# EAGLE schematic alim (EAGLE 4.16)
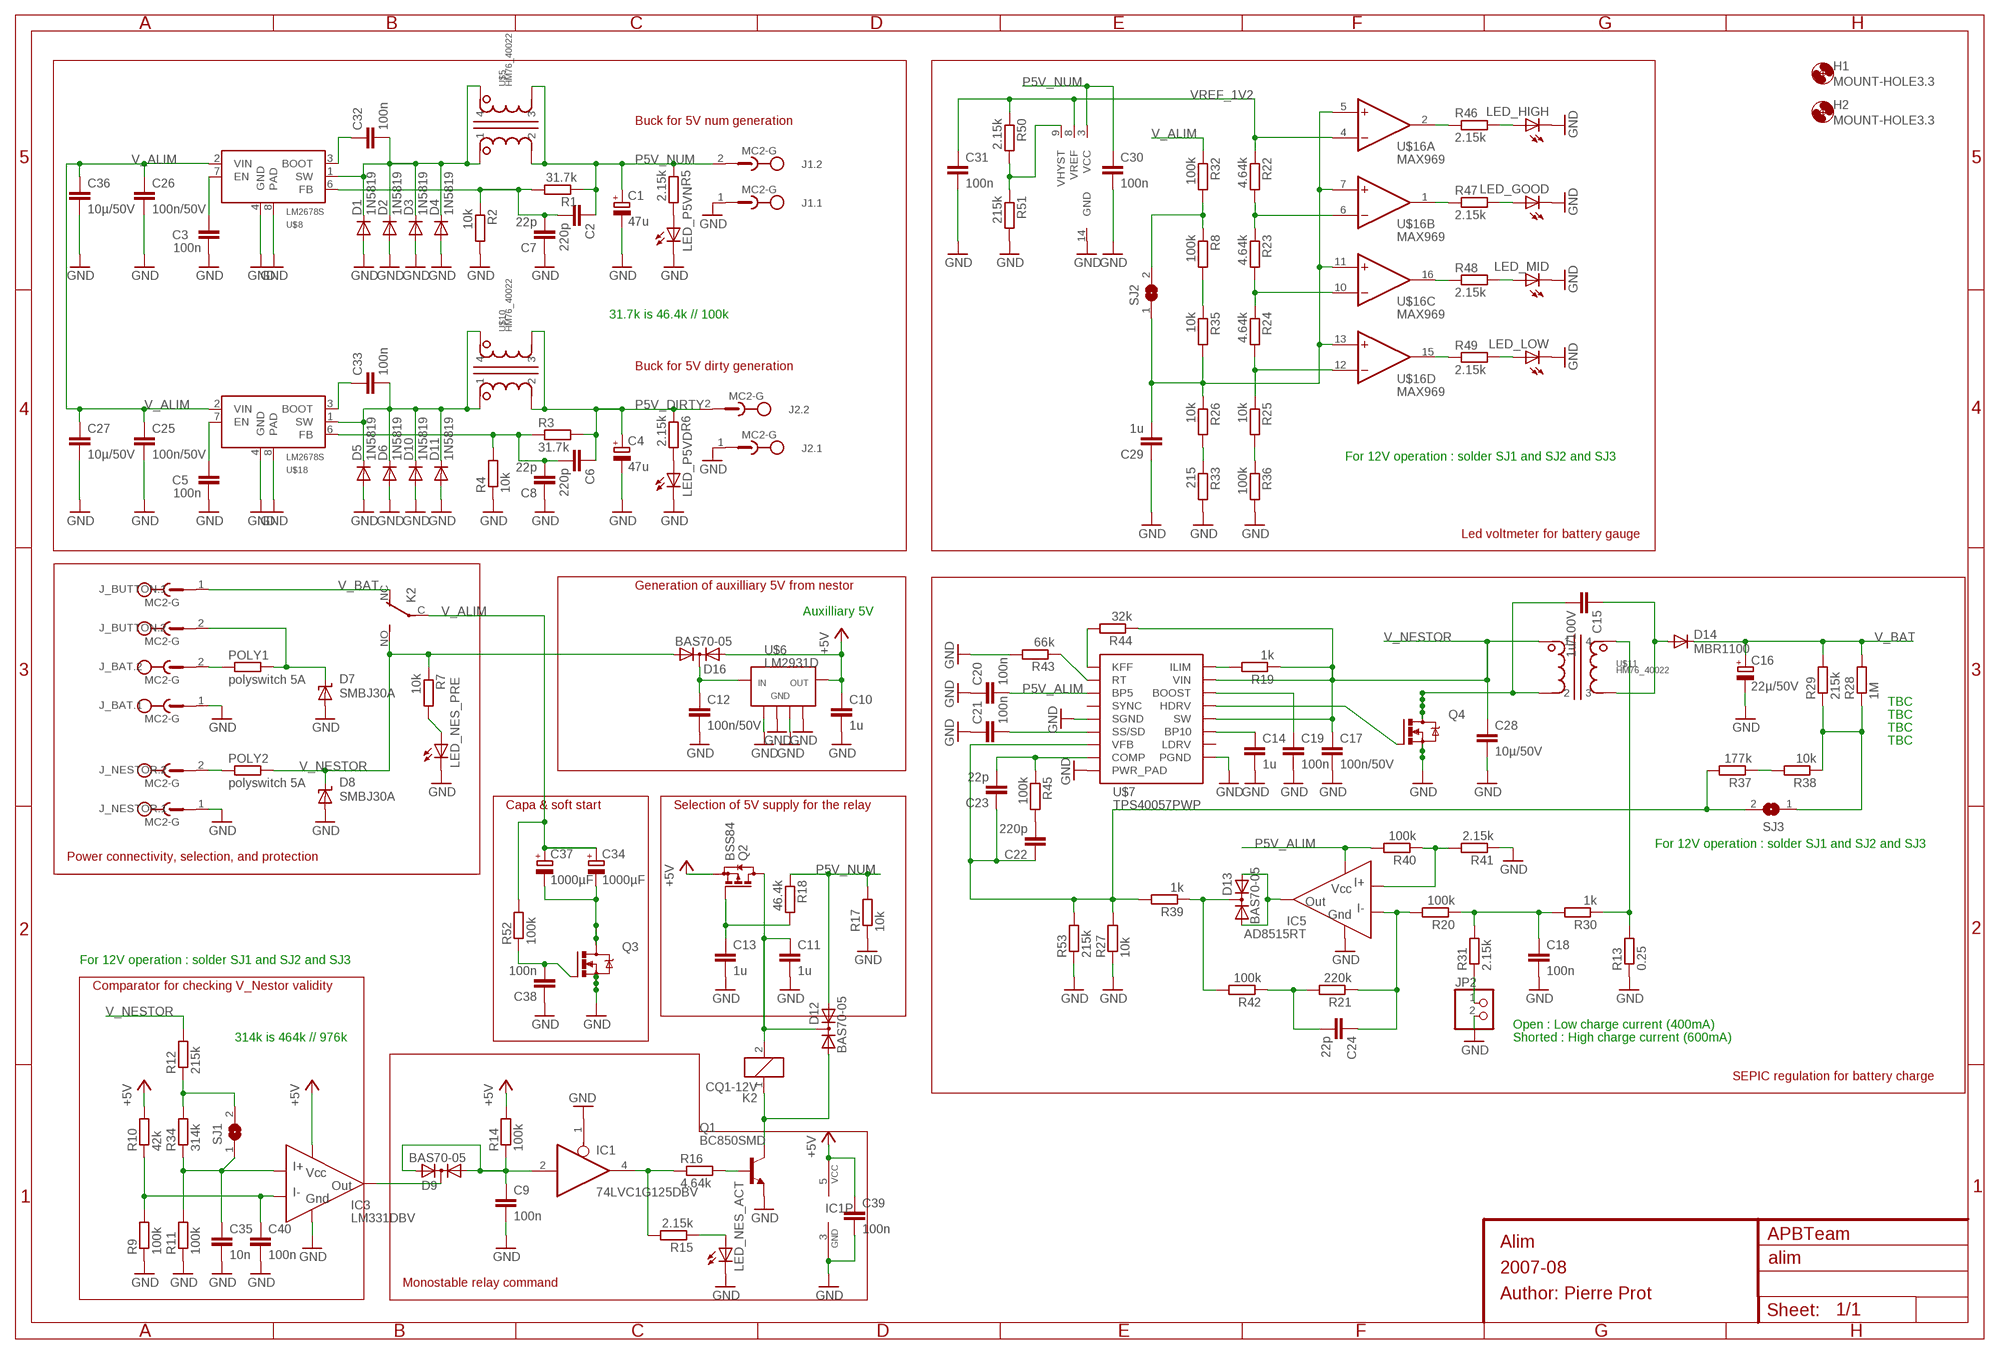
[diagram p0: schematic, sheet 1]

## Parts
C1  47u  CPOL-EUE  [PANASONIC_E]
C2  220p  C-EUC0603  [C0603]
C3  100n  C-EUC0603  [C0603]
C4  47u  CPOL-EUE  [PANASONIC_E]
C5  100n  C-EUC0603  [C0603]
C6  220p  C-EUC0603  [C0603]
C7  22p  C-EUC0603  [C0603]
C8  22p  C-EUC0603  [C0603]
C9  100n  C-EUC0603  [C0603]
C10  1u  C-EUC0603  [C0603]
C11  1u  C-EUC0603  [C0603]
C12  100n/50V  C-EUC0805  [C0805]
C13  1u  C-EUC0603  [C0603]
C14  1u  C-EUC0603  [C0603]
C15  1u/100V  C-EUC1206K  [C1206K]
C16  22µ/50V  CPOL-EUE  [PANASONIC_E]
C17  100n/50V  C-EUC0805  [C0805]
C18  100n  C-EUC0603  [C0603]
C19  100n  C-EUC0603  [C0603]
C20  100n  C-EUC0603  [C0603]
C21  100n  C-EUC0603  [C0603]
C22  220p  C-EUC0603  [C0603]
C23  22p  C-EUC0603  [C0603]
C24  22p  C-EUC0603  [C0603]
C25  100n/50V  C-EUC0805  [C0805]
C26  100n/50V  C-EUC0805  [C0805]
C27  10µ/50V  C-EUC2220K  [C2220K]
C28  10µ/50V  C-EUC2220K  [C2220K]
C29  1u  C-EUC0603  [C0603]
C30  100n  C-EUC0603  [C0603]
C31  100n  C-EUC0603  [C0603]
C32  100n  C-EUC0603  [C0603]
C33  100n  C-EUC0603  [C0603]
C34  1000µF  CPOL-EU""  [E5-13_RADIAL$]
C35  10n  C-EUC0603  [C0603]
C36  10µ/50V  C-EUC2220K  [C2220K]
C37  1000µF  CPOL-EU""  [E5-13_RADIAL$]
C38  100n  C-EUC0603  [C0603]
C39  100n  C-EUC0603  [C0603]
C40  100n  C-EU0603_SMALL  [0603_SMALL]
D1  1N5819  DIODE-DO41-10  [DO41-10]
D2  1N5819  DIODE-DO41-10  [DO41-10]
D3  1N5819  DIODE-DO41-10  [DO41-10]
D4  1N5819  DIODE-DO41-10  [DO41-10]
D5  1N5819  DIODE-DO41-10  [DO41-10]
D6  1N5819  DIODE-DO41-10  [DO41-10]
D7  SMBJ30A  SUPPRESSOR-SMBJ  [SMBJ]
D8  SMBJ30A  SUPPRESSOR-SMBJ  [SMBJ]
D9  BAS70-05  [SOT23]
D10  1N5819  DIODE-DO41-10  [DO41-10]
D11  1N5819  DIODE-DO41-10  [DO41-10]
D12  BAS70-05  [SOT23]
D13  BAS70-05  [SOT23]
D14  MBR1100  DIODE-DO41-10  [DO41-10]
D16  BAS70-05  [SOT23]
H1  MOUNT-HOLE3.3  [3,3]
H2  MOUNT-HOLE3.3  [3,3]
IC1  74LVC1G125DBV  [SOT23-5]
IC3  LM331DBV  [SOT23-6]
IC5  AD8515RT  [SOT23-5]
J1  MC2-G  [MC2-G]
J2  MC2-G  [MC2-G]
J_BAT  MC2-G  [MC2-G]
J_BUTTON  MC2-G  [MC2-G]
J_NESTOR  MC2-G  [MC2-G]
JP2  PINHD-1X2  [1X02]
K2  CQ1-12V  [CQ1]
LED_GOOD  LEDCHIPLED_1206  [CHIPLED_1206]
LED_HIGH  LEDCHIPLED_1206  [CHIPLED_1206]
LED_LOW  LEDCHIPLED_1206  [CHIPLED_1206]
LED_MID  LEDCHIPLED_1206  [CHIPLED_1206]
LED_NES_ACT  LEDCHIPLED_1206  [CHIPLED_1206]
LED_NES_PRE  LEDCHIPLED_1206  [CHIPLED_1206]
LED_P5VD  LEDCHIPLED_1206  [CHIPLED_1206]
LED_P5VN  LEDCHIPLED_1206  [CHIPLED_1206]
POLY1  polyswitch 5A  R-EU_0411/12  [0411/12]
POLY2  polyswitch 5A  R-EU_0411/12  [0411/12]
Q1  BC850SMD  [SOT23-BEC]
Q2  BSS84  [SOT23]
Q3  N-MOSFET-SO8S  [SO-08]
Q4  N-MOSFET-SO8S  [SO-08]
R1  31.7k  R-EU_R0603  [R0603]
R2  10k  R-EU_R0603  [R0603]
R3  31.7k  R-EU_R0603  [R0603]
R4  10k  R-EU_R0603  [R0603]
R5  2.15k  R-EU_R0603  [R0603]
R6  2.15k  R-EU_R0603  [R0603]
R7  10k  R-EU_R0603  [R0603]
R8  100k  R-EU_R0603  [R0603]
R9  100k  R-EU_R0603  [R0603]
R10  42k  R-EU_R0603  [R0603]
R11  100k  R-EU_R0603  [R0603]
R12  215k  R-EU_R0603  [R0603]
R13  0.25  R-EU_R0603  [R0603]
R14  100k  R-EU_R0603  [R0603]
R15  2.15k  R-EU_R0603  [R0603]
R16  4.64k  R-EU_R0603  [R0603]
R17  10k  R-EU_R0603  [R0603]
R18  46.4k  R-EU_R0603  [R0603]
R19  1k  R-EU_R0603  [R0603]
R20  100k  R-EU_R0603  [R0603]
R21  220k  R-EU_R0603  [R0603]
R22  4.64k  R-EU_R0603  [R0603]
R23  4.64k  R-EU_R0603  [R0603]
R24  4.64k  R-EU_R0603  [R0603]
R25  10k  R-EU_R0603  [R0603]
R26  10k  R-EU_R0603  [R0603]
R27  10k  R-EU_R0603  [R0603]
R28  1M  R-EU_R0603  [R0603]
R29  215k  R-EU_R0603  [R0603]
R30  1k  R-EU_R0603  [R0603]
R31  2.15k  R-EU_R0603  [R0603]
R32  100k  R-EU_R0603  [R0603]
R33  215  R-EU_R0603  [R0603]
R34  314k  R-EU_R0603  [R0603]
R35  10k  R-EU_R0603  [R0603]
R36  100k  R-EU_R0603  [R0603]
R37  177k  R-EU_R0603  [R0603]
R38  10k  R-EU_R0603  [R0603]
R39  1k  R-EU_R0603  [R0603]
R40  100k  R-EU_R0603  [R0603]
R41  2.15k  R-EU_R0603  [R0603]
R42  100k  R-EU_R0603  [R0603]
R43  66k  R-EU_R0603  [R0603]
R44  32k  R-EU_R0603  [R0603]
R45  100k  R-EU_R0603  [R0603]
R46  2.15k  R-EU_R0603  [R0603]
R47  2.15k  R-EU_R0603  [R0603]
R48  2.15k  R-EU_R0603  [R0603]
R49  2.15k  R-EU_R0603  [R0603]
R50  2.15k  R-EU_R0603  [R0603]
R51  215k  R-EU_R0603  [R0603]
R52  100k  R-EU_R0603  [R0603]
R53  215k  R-EU_R0603  [R0603]
SJ1  SJ  [SJ]
SJ2  SJ  [SJ]
SJ3  SJ  [SJ]
U$5  HM76_40022  HM76_40  [HM76_40]
U$6  LM2931D  LM2931  [SO08]
U$7  TPS40057PWP  [PDSO16]
U$8  LM2678S  [TO263-7]
U$10  HM76_40022  HM76_40  [HM76_40]
U$11  HM76_40022  HM76_40  [HM76_40]
U$16  MAX969  [QSOP16]
U$18  LM2678S  [TO263-7]

## Nets
+5V: C10.1 C39.1 D16.2(A2) IC1.5(VCC) IC3.6(VCC) Q2.2(S) R10.2 R14.2 U$6.1(OUT)
GND: C1.- C3.1 C4.- C5.1 C7.1 C8.1 C9.2 C10.2 C11.2 C12.2 C13.2 C14.2 C16.- C17.2 C18.2 C19.2 C20.1 C21.1 C25.2 C26.2 C27.2 C28.2 C29.1 C30.2 C31.2 C35.2 C36.2 C38.1 C39.2 C40.2 D1.A D2.A D3.A D4.A D5.A D6.A D7.A D8.A D10.A D11.A IC1.1(OE) IC1.3(GND) IC3.2(VSS) IC5.2(VSS) J1.1 J2.1 J_BAT.1 J_NESTOR.1 JP2.2 LED_GOOD.C LED_HIGH.C LED_LOW.C LED_MID.C LED_NES_ACT.C LED_NES_PRE.C LED_P5VD.C LED_P5VN.C Q1.E Q3.1(S) Q3.2(S) Q3.3(S) Q4.1(S) Q4.2(S) Q4.3(S) R2.2 R4.1 R9.1 R11.1 R13.1 R17.1 R27.1 R33.2 R36.2 R41.1 R43.2 R51.2 R53.1 U$6.2(GND) U$6.3(GND2) U$6.6(GND3) U$6.7(GND4) U$7.P$5(SGND) U$7.P$9(PGND) U$7.P$17(PWR_PAD) U$8.4(GND) U$8.8(PAD) U$16.14(GND) U$18.4(GND) U$18.8(PAD)
N$1: C32.2 D1.C D2.C D3.C D4.C U$5.P$1 U$5.P$4 U$8.1(SW)
N$2: D12.1(A1) K2.1 Q1.C
N$3: C2.2 C7.2 R1.2 R2.1 U$8.6(FB)
N$4: C6.2 C8.2 R3.1 R4.2 U$18.6(FB)
N$5: C5.2 U$18.7(EN)
N$6: C3.2 U$8.7(EN)
N$7: IC1.4(O) R15.2 R16.1
N$8: C33.2 D5.C D6.C D10.C D11.C U$10.P$1 U$10.P$4 U$18.1(SW)
N$9: LED_P5VN.A R5.2
N$10: LED_P5VD.A R6.2
N$11: LED_NES_PRE.A R7.2
N$12: J_BAT.2 POLY1.1
N$13: J_NESTOR.2 POLY2.1
N$14: C40.1 IC3.3(I-) R9.2 R10.1
N$15: C35.1 IC3.1(I+) R11.2 R34.1 SJ1.1
N$16: C9.1 D9.1(A1) D9.2(A2) IC1.2(I) R14.1
N$17: D9.3(C) IC3.4(OUT)
N$18: LED_NES_ACT.A R15.1
N$19: C13.1 Q2.1(G) R18.2
N$20: R22.2 R23.1 U$16.6(B:-IN)
N$21: Q4.4(G) U$7.P$13(HDRV)
N$22: D7.C J_BUTTON.2 POLY1.2
N$23: Q1.B R16.2
N$24: C11.1 D12.3(C) K2.2 Q2.3(D)
N$25: C19.1 U$7.P$14(BOOST)
N$26: C14.1 U$7.P$11(BP10)
N$27: R46.1 U$16.2(A:OUT)
N$28: R19.2 U$7.P$16(ILIM)
N$29: R23.2 R24.1 U$16.10(C:-IN)
N$30: R24.2 R25.1 U$16.12(D:-IN)
N$31: R50.2 R51.1 U$16.9(VHYST)
N$32: C29.2 R26.1 R35.2 SJ2.1 U$16.5(A:+IN) U$16.7(B:+IN) U$16.11(C:+IN) U$16.13(D:+IN)
N$33: R8.2 R35.1
N$34: C15.2 Q4.5(D) Q4.6(D) Q4.7(D) Q4.8(D) U$11.P$2
N$35: C15.1 D14.A U$11.P$3
N$36: R28.1 R29.1 R38.1 SJ3.1
N$37: R47.1 U$16.1(B:OUT)
N$40: R13.2 R30.1 U$11.P$4
N$41: C18.1 R20.1 R30.2 R31.2
N$42: R12.1 R34.2 SJ1.2
N$43: R8.1 R32.2 SJ2.2
N$44: C32.1 U$8.3(BOOT)
N$45: R26.2 R33.1
N$46: R25.2 R36.1
N$47: R37.1 R38.2
N$48: D13.1(A1) D13.2(A2) IC5.1(OUT)
N$49: D13.3(C) R39.1 R42.2
N$50: C22.1 C23.1 R27.2 R37.2 R39.2 R53.2 SJ3.2 U$7.P$7(VFB)
N$51: C24.1 IC5.4(I-) R20.2 R21.1
N$52: IC5.3(I+) R40.1 R41.2
N$53: C24.2 R21.2 R42.1
N$54: JP2.1 R31.1
N$55: R48.1 U$16.16(C:OUT)
N$56: C21.2 U$7.P$6(SS/SD)
N$57: R43.1 U$7.P$2(RT)
N$58: R44.2 U$7.P$1(KFF)
N$59: C23.2 R45.1 U$7.P$8(COMP)
N$60: C22.2 R45.2
N$61: R49.1 U$16.15(D:OUT)
N$62: LED_HIGH.A R46.2
N$63: LED_GOOD.A R47.2
N$64: LED_MID.A R48.2
N$65: LED_LOW.A R49.2
N$66: C33.1 U$18.3(BOOT)
N$68: C38.2 Q3.4(G) R52.1
N$69: C34.- C37.- Q3.5(D) Q3.6(D) Q3.7(D) Q3.8(D)
N$73: C12.1 D16.3(C) U$6.8(IN)
P5V_ALIM: C20.2 IC5.5(VCC) R40.2 U$7.P$3(BP5)
P5V_DIRTY: C4.+ C6.1 J2.2 R3.2 R6.1 U$10.P$2 U$10.P$3
P5V_NUM: C1.+ C2.1 C30.1 D12.2(A2) J1.2 R1.1 R5.1 R17.2 R18.1 U$5.P$2 U$5.P$3 U$16.3(VCC)
V_ALIM: C25.1 C26.1 C27.1 C34.+ C36.1 C37.+ K2.C(2:P) R32.1 R52.2 U$8.2(VIN) U$18.2(VIN)
V_BAT: C16.+ D14.C J_BUTTON.1 K2.NC(2:O) R28.2 R29.2
V_NESTOR: C17.1 C28.1 D8.C D16.1(A1) K2.NO(2:S) POLY2.2 R7.1 R12.2 R19.1 R44.1 U$7.P$12(SW) U$7.P$15(VIN) U$11.P$1
VREF_1V2: C31.1 R22.1 R50.1 U$16.4(A:-IN) U$16.8(VREF)
Unconnected: U$7.P$4(SYNC) U$7.P$10(LDRV)

## Notes on the sheet
- Buck for 5V num generation
- 31.7k is 46.4k // 100k
- Buck for 5V dirty generation
- For 12V operation : solder SJ1 and SJ2 and SJ3
- Led voltmeter for battery gauge
- Generation of auxilliary 5V from nestor
- Auxilliary 5V
- TBC
- TBC
- TBC
- TBC
- Capa & soft start | Selection of 5V supply for the relay
- For 12V operation : solder SJ1 and SJ2 and SJ3
- Power connectivity, selection, and protection
- For 12V operation : solder SJ1 and SJ2 and SJ3
- Comparator for checking V_Nestor validity
- Open : Low charge current (400mA)
- 314k is 464k // 976k | Shorted : High charge current (600mA)
- SEPIC regulation for battery charge
- APBTeam
- Alim
- 2007-08
- Monostable relay command
- Author: Pierre Prot

## Library data of the parts
C1 C4 C16 C34 C37 = rcl:CPOL-EU: POLARIZED CAPACITOR, European symbol
C2 C3 C5-C15 C17-C33 C35 C36 C38-C40 = rcl:C-EU: CAPACITOR, European symbol
D1-D6 D10 D11 D14 = diode:DIODE-: DIODE
D7 D8 = diode:SUPPRESSOR-: Suppressor diode
D9 D12 D13 D16 = diode:BAS70-05: Silicon Schottky Diodes General-purpose diode for high-speed switching
H1 H2 = holes:MOUNT-HOLE: MOUNTING HOLE with drill center marker
IC1 = 74xx-little-us:74*1G125: Single Bus Buffer Gate with 3-State Output
IC3 = robot:LM331
IC5 = robot:AD8515
J1 J2 J_BAT J_BUTTON J_NESTOR = con-phoenix-381_l:MC2-G: Mini-Combicon 3.81mm horizontal 2-polig MC 1,5/2-G-3,81 Artikel-Nr. 1803277 mit Gegenstecker MC 1,5/2-ST-3,81 Artikel-Nr. 1803578
JP2 = pinhead:PINHD-1X2: PIN HEADER
K2 = relay:CQ1-12V: AUTOMOTIVE QUIET RELAY NAiS Source: http://www.mew-europe.com/.. en_ds_61208_0000.pdf
LED_GOOD LED_HIGH LED_LOW LED_MID LED_NES_ACT LED_NES_PRE LED_P5VD LED_P5VN = led:LED: LED OSRAM: - CHIPLED LG R971, LG N971, LY N971, LG Q971, LY Q971, LO R971, LY R971 LH N974, LH R974 LS Q976, LO Q976, LY Q976 LO Q996 - Hyper CHIPLED LW Q18S LB Q993, LB Q99A, LB R99A - SideLED LS A670, LO A670, LY A670, LG A670, LP A670 LB A673, LV A673, LT A673, LW A673 LH A674 LY A675 LS A676, LA A676, LO A676, LY A676, LW A676 LS A679, LY A679, LG A679 - Hyper Micro SIDELED® LS Y876, LA Y876, LO Y876, LY Y876 LT Y87S - SmartLED LW L88C, LW L88S LB L89C, LB L89S, LG L890 LS L89K, LO L89K, LY L89K LS L896, LA L896, LO L896, LY L896 - TOPLED LS T670, LO T670, LY T670, LG T670, LP T670 LSG T670, LSP T670, LSY T670, LOP T670, LYG T670 LG T671, LOG T671, LSG T671 LB T673, LV T673, LT T673, LW T673 LH T674 LS T676, LA T676, LO T676, LY T676, LB T676, LH T676, LSB T676, LW T676 LB T67C, LV T67C, LT T67C, LS T67K, LO T67K, LY T67K, LW E67C LS E67B, LA E67B, LO E67B, LY E67B, LB E67C, LV E67C, LT E67C LW T67C LS T679, LY T679, LG T679 LS T770, LO T770, LY T770, LG T770, LP T770 LB T773, LV T773, LT T773, LW T773 LH T774 LS E675, LA E675, LY E675, LS T675 LS T776, LA T776, LO T776, LY T776, LB T776 LHGB T686 LT T68C, LB T68C - Hyper Mini TOPLED® LB M676 - Mini TOPLED Santana® LG M470 LS M47K, LO M47K, LY M47K Source: http://www.osram.convergy.de/
POLY1 POLY2 R1-R53 = rcl:R-EU_: RESISTOR, European symbol
Q1 = transistor-npn:BC850*: NPN Transistor
Q2 = transistor-small-signal:BSS84: P-CHANNEL MOS FET
Q3 Q4 = transistor-power:N-MOSFET-SO8: N-Channel MOSFET Example: FDS7760A; N-Channel Logic Level PowerTrench® MOSFET FDS2572; N-Channel UltraFET® Trench MOSFET Source: www.fairchildsemi.com
SJ1-SJ3 = jumper:SJ: SMD solder JUMPER
U$5 U$10 U$11 = robot:HM76_40
U$6 = robot:LM2931
U$7 = robot:TPS40057
U$8 U$18 = robot:LM2678
U$16 = maxim-7:MAX969